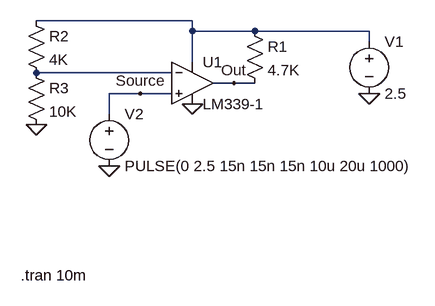
[diagram p0: schematic LM339.asc]
LM339.asc, the LTspice schematic file:
Version 4
SHEET 1 880 680
WIRE 96 112 -144 112
WIRE 96 128 96 112
WIRE 192 128 96 128
WIRE 368 128 192 128
WIRE 368 144 368 128
WIRE 96 176 96 128
WIRE 64 192 -144 192
WIRE 160 208 128 208
WIRE 192 208 160 208
WIRE 16 224 -32 224
WIRE 64 224 16 224
WIRE -32 256 -32 224
FLAG 368 224 0
FLAG 96 240 0
FLAG -144 272 0
FLAG -32 336 0
FLAG 16 224 Source
FLAG 160 208 Out
SYMBOL res 176 112 R0
SYMATTR InstName R1
SYMATTR Value 4.7K
SYMBOL voltage 368 128 R0
WINDOW 123 0 0 Left 0
WINDOW 39 0 0 Left 0
SYMATTR InstName V1
SYMATTR Value 2.5
SYMBOL res -160 96 R0
SYMATTR InstName R2
SYMATTR Value 4K
SYMBOL res -160 176 R0
SYMATTR InstName R3
SYMATTR Value 10K
SYMBOL voltage -32 240 R0
WINDOW 123 0 0 Left 0
WINDOW 39 0 0 Left 0
SYMATTR InstName V2
SYMATTR Value PULSE(0 2.5 15n 15n 15n 10u 20u 1000)
SYMBOL Comparators\\LM339-1 96 208 R0
SYMATTR InstName U1
TEXT -168 504 Left 0 !.tran 10m

The netlist it stands for:
* LM339.asc
R1 N001 Out 4.7K
V1 N001 0 2.5
R2 N001 N002 4K
R3 N002 0 10K
V2 Source 0 PULSE(0 2.5 15n 15n 15n 10u 20u 1000)
* U1: LM339-1 (symbol Comparators\LM339-1 not available, pins judged from their places): In+=Source In-=N002 V+=N001 V-=0 OUT=Out
.tran 10m
.backanno
.end